# Altium schematic sheet IMU.SchDoc: IMU
size 420 x 297 mm; SheetNumber: 5
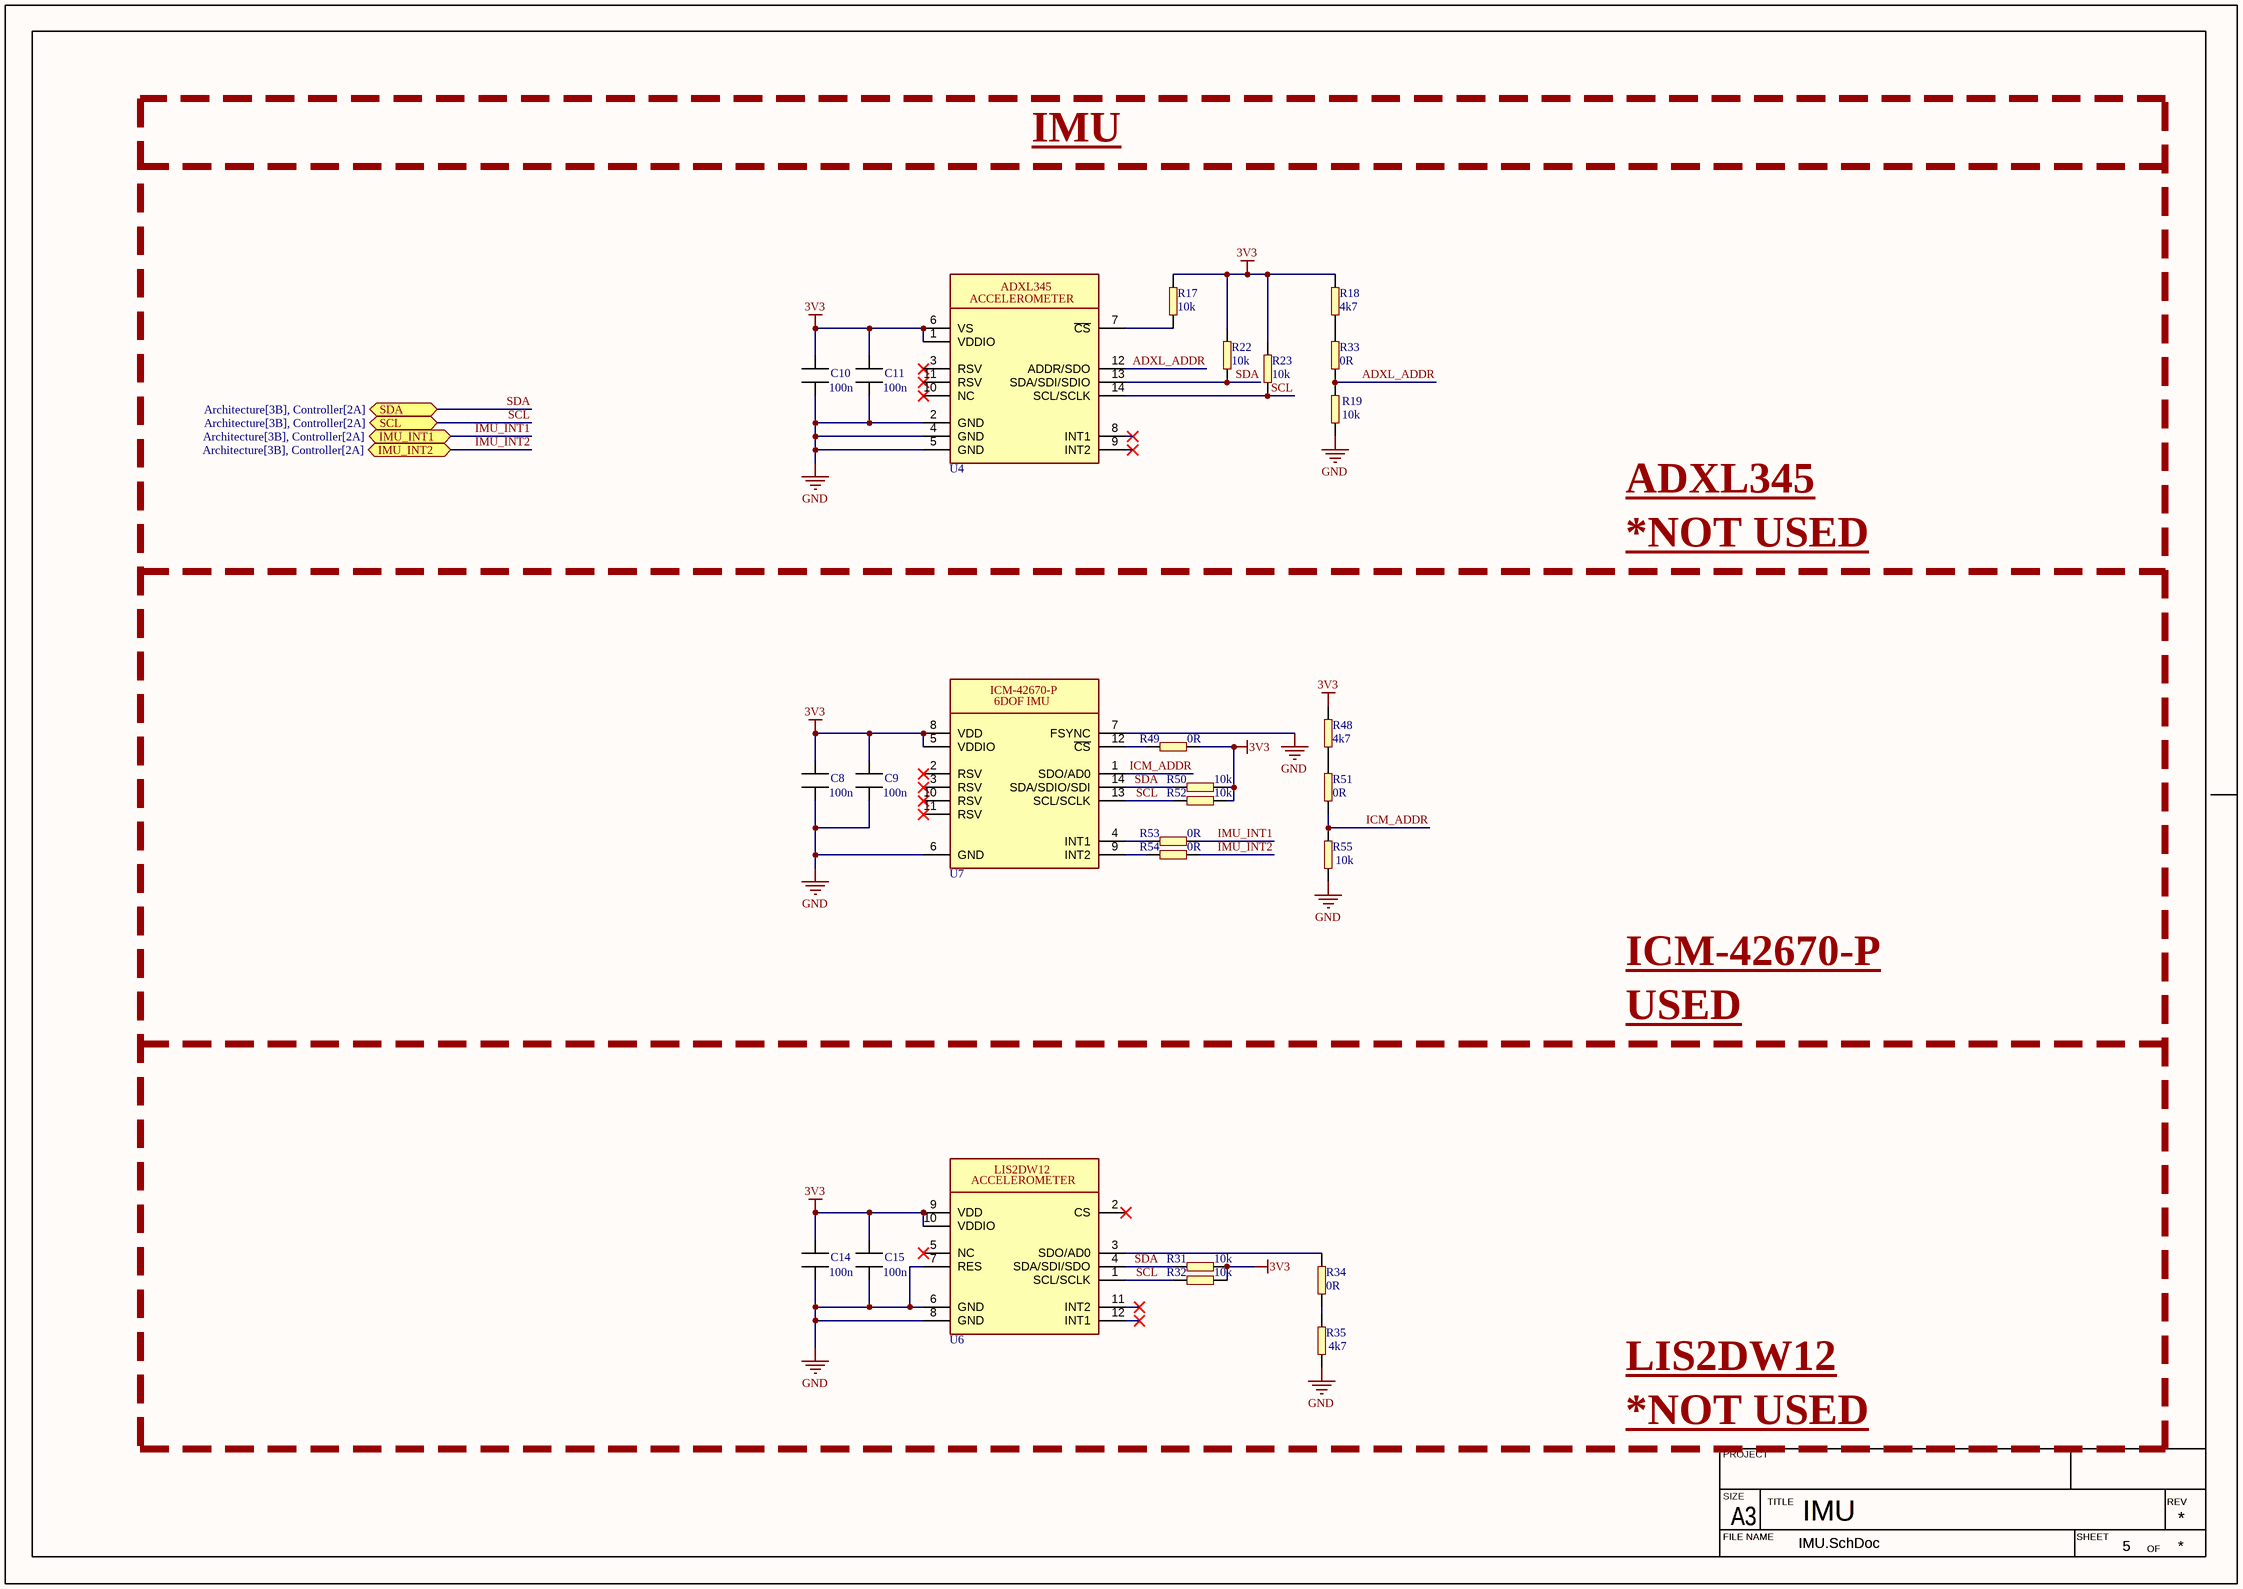
[diagram p0: IMU.SchDoc]

## Parts
C8  value 100n  [CAPC1608X10N]  (hidden comment: ERP_102-1)
C9  value 100n  [CAPC1608X10N]  (hidden comment: ERP_102-1)
C10  value 100n  [CAPC1608X10N]  (hidden comment: ERP_102-1)  (graphical)
C11  value 100n  [CAPC1608X10N]  (hidden comment: ERP_102-1)  (graphical)
C14  value 100n  [CAPC1608X10N]  (hidden comment: ERP_102-1)  (graphical)
C15  value 100n  [CAPC1608X10N]  (hidden comment: ERP_102-1)  (graphical)
R17  value 10k  [RES_0603]  (hidden comment: ERP_101-1)  (graphical)
R18  value 4k7  [RES_0603]  (hidden comment: ERP_101-1)  (graphical)
R19  value 10k  [RES_0603]  (hidden comment: ERP_101-1)  (graphical)
R22  value 10k  [RES_0603]  (hidden comment: ERP_101-1)  (graphical)
R23  value 10k  [RES_0603]  (hidden comment: ERP_101-1)  (graphical)
R31  value 10k  [RES_0603]  (hidden comment: ERP_101-1)  (graphical)
R32  value 10k  [RES_0603]  (hidden comment: ERP_101-1)  (graphical)
R33  value 0R  [RES_0603]  (hidden comment: ERP_101-1)  (graphical)
R34  value 0R  [RES_0603]  (hidden comment: ERP_101-1)  (graphical)
R35  value 4k7  [RES_0603]  (hidden comment: ERP_101-1)  (graphical)
R48  value 4k7  [RES_0603]  (hidden comment: ERP_101-1)
R49  value 0R  [RES_0603]  (hidden comment: ERP_101-1)
R50  value 10k  [RES_0603]  (hidden comment: ERP_101-1)
R51  value 0R  [RES_0603]  (hidden comment: ERP_101-1)  (no BOM)
R52  value 10k  [RES_0603]  (hidden comment: ERP_101-1)
R53  value 0R  [RES_0603]  (hidden comment: ERP_101-1)
R54  value 0R  [RES_0603]  (hidden comment: ERP_101-1)
R55  value 10k  [RES_0603]  (hidden comment: ERP_101-1)
U4  ADXL345  [ADXL345]  (value not drawn)  (graphical)
U6  LIS2DW12  [LIS2DW12]  (value not drawn)  (graphical)
U7  ICM42670P  [ICM42670P]  (value not drawn)

## Ports
IMU_INT1 (bidir, see Architecture[3B], Controller[2A]), IMU_INT2 (bidir, see Architecture[3B], Controller[2A]), SCL (bidir, see Architecture[3B], Controller[2A]), SDA (bidir, see Architecture[3B], Controller[2A])

## Nets
3V3: C8.1 C9.1 C10.1 C11.1 C14.1 C15.1 R17.2 R18.2 R22.2 R23.2 R31.1 R32.1 R48.2 R49.1 R50.1 R52.1 U4.1(VDDIO) U4.6(VS) U6.9(VDD) U6.10(VDDIO) U7.5(VDDIO) U7.8(VDD)
GND: C8.2 C9.2 C10.2 C11.2 C14.2 C15.2 R19.1 R35.1 R55.1 U4.2(GND) U4.4(GND) U4.5(GND) U6.6(GND) U6.7(RES) U6.8(GND) U7.6(GND) U7.7(FSYNC)
ADXL_ADDR: R19.2 R33.1 U4.12(ADDR/SDO)
ICM_ADDR: R51.1 R55.2 U7.1(SDO/AD0)
IMU_INT1: R53.1 ; port IMU_INT1
IMU_INT2: R54.1 ; port IMU_INT2
SCL: R23.1 R32.2 R52.2 U4.14(SCL/SCLK) U6.1(SCL/SCLK) U7.13(SCL/SCLK) ; port SCL
SDA: R22.1 R31.2 R50.2 U4.13(SDA/SDI/SDIO) U6.4(SDA/SDI/SDO) U7.14(SDA/SDIO/SDI) ; port SDA
NetR17_1: R17.1 U4.7(~{CS})
NetR18_1: R18.1 R33.2
NetR34_1: R34.1 R35.2
NetR34_2: R34.2 U6.3(SDO/AD0)
NetR48_1: R48.1 R51.2
NetR49_2: R49.2 U7.12(~{CS})
NetR53_2: R53.2 U7.4(INT1)
NetR54_2: R54.2 U7.9(INT2)

Not connected (* = marked no-connect by the designer): U4 3(RSV)* 8(INT1)* 9(INT2)* 10(NC)* 11(RSV)*; U6 2(CS)* 5(NC)* 11(INT2)* 12(INT1)*; U7 2(RSV)* 3(RSV)* 10(RSV)* 11(RSV)*

## Notes on the sheet
- IMU
- ADXL345
- *NOT USED
- ICM-42670-P
- USED
- LIS2DW12
- PROJECT
- SIZE
- FILE NAME
- A3
- TITLE
- SHEET
- OF
- REV
- (in symbol ADXL345) ACCELEROMETER
- (in symbol ICM42670P) 6DOF IMU
- (in symbol LIS2DW12) ACCELEROMETER

## Library data of the parts
C8-C11 C14 C15 = MLCC_0603: Chip Capacitor, 2-Leads, Body 1.60x0.80mm, IPC Medium Density; Package: 0603; Manufacturer 1: *; Manufacturer Part Number 1: *; Supplier 1: *; Suuplier Part Number 1: *; ERP: *
R17-R19 R22 R23 R31-R35 R48-R55 = RES_0603: Package: 0603; Manufacturer 1: *; Manufacturer Part Number 1: *; Supplier 1: *; Supplier Part Number 1: *; ERP: *
U4 = ADXL345: ACCEL 2-16G I2C/SPI 14LGA; Manufacturer 1: Analog Devices Inc.; Manufacturer Part Number 1: ADXL345BCCZ-RL7; Value: *
U6 = LIS2DW12: ACCEL 2-16G I2C/SPI 12LGA; Manufacturer 1: STMicroelectronics; Value: *; Manufacturer Part Number 1: *
U7 = ICM42670P: IMU ACCEL/GYRO/TEMP I2C/SPI; Manufacturer Part Number 1: ICM-42670-P; Manufacturer 1: TDK InvenSense; Value: *